# EAGLE design TickerTapeAlphanumeric (EAGLE 9.3.1)
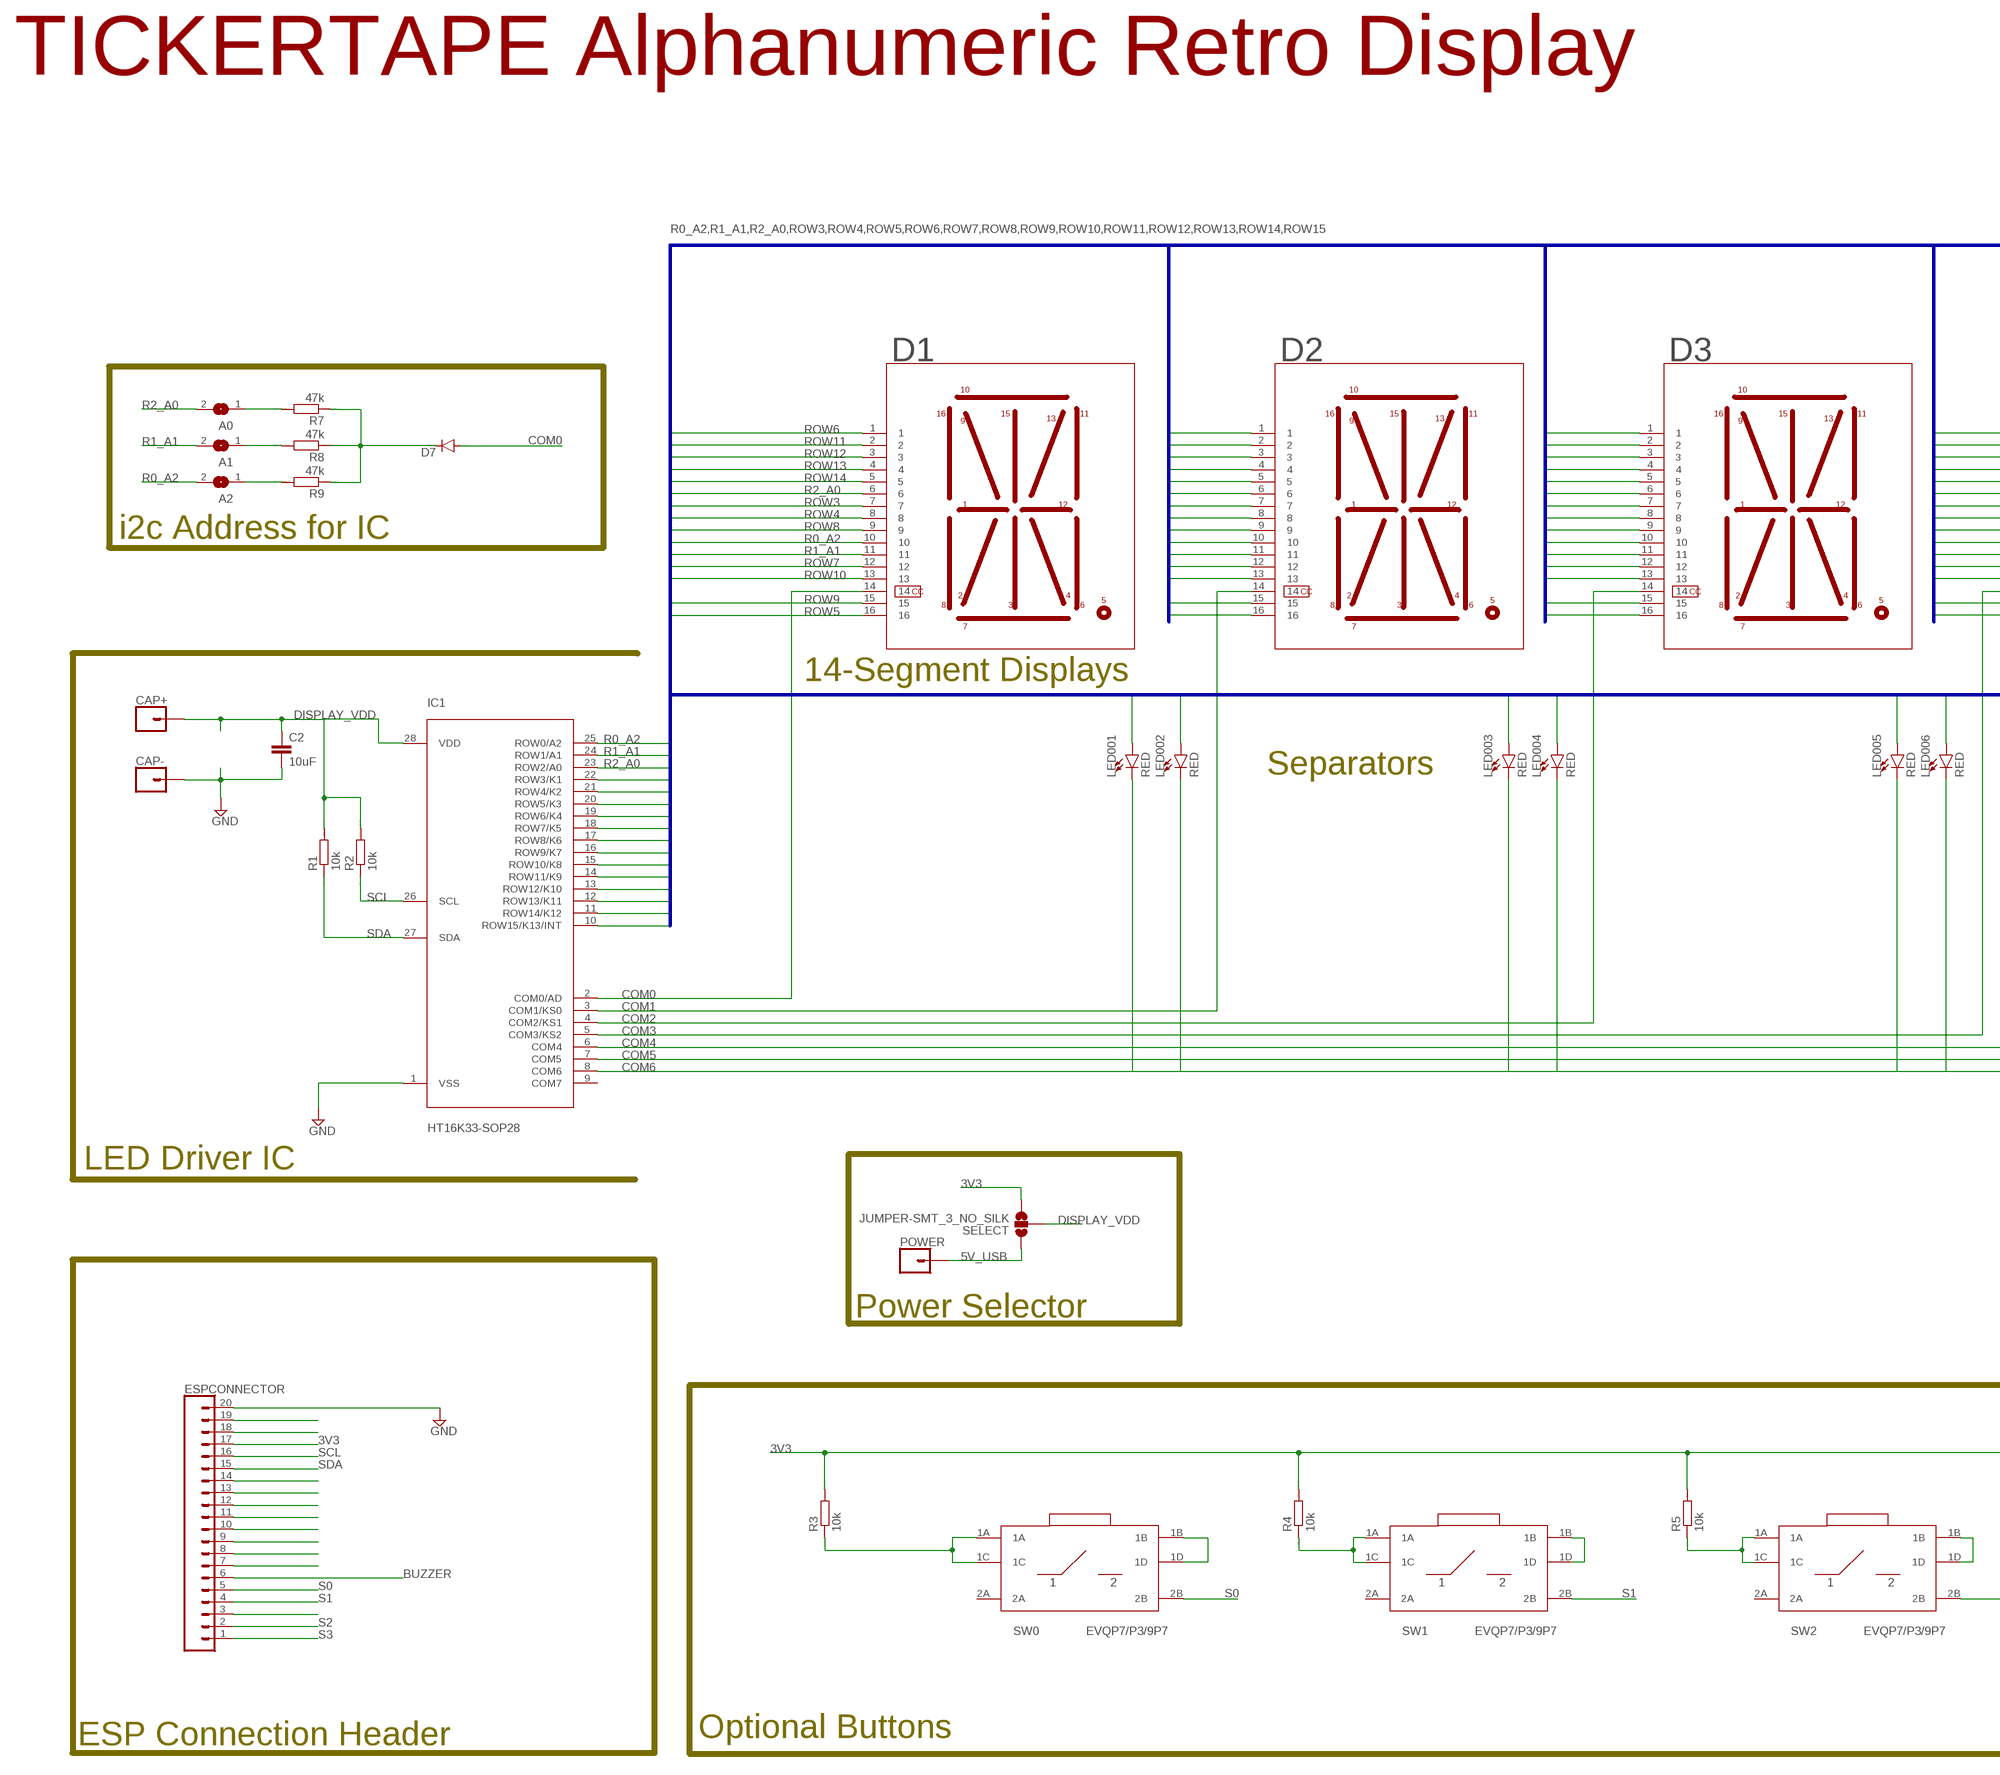
[diagram p0: schematic, sheet 1, part 1 of 2]
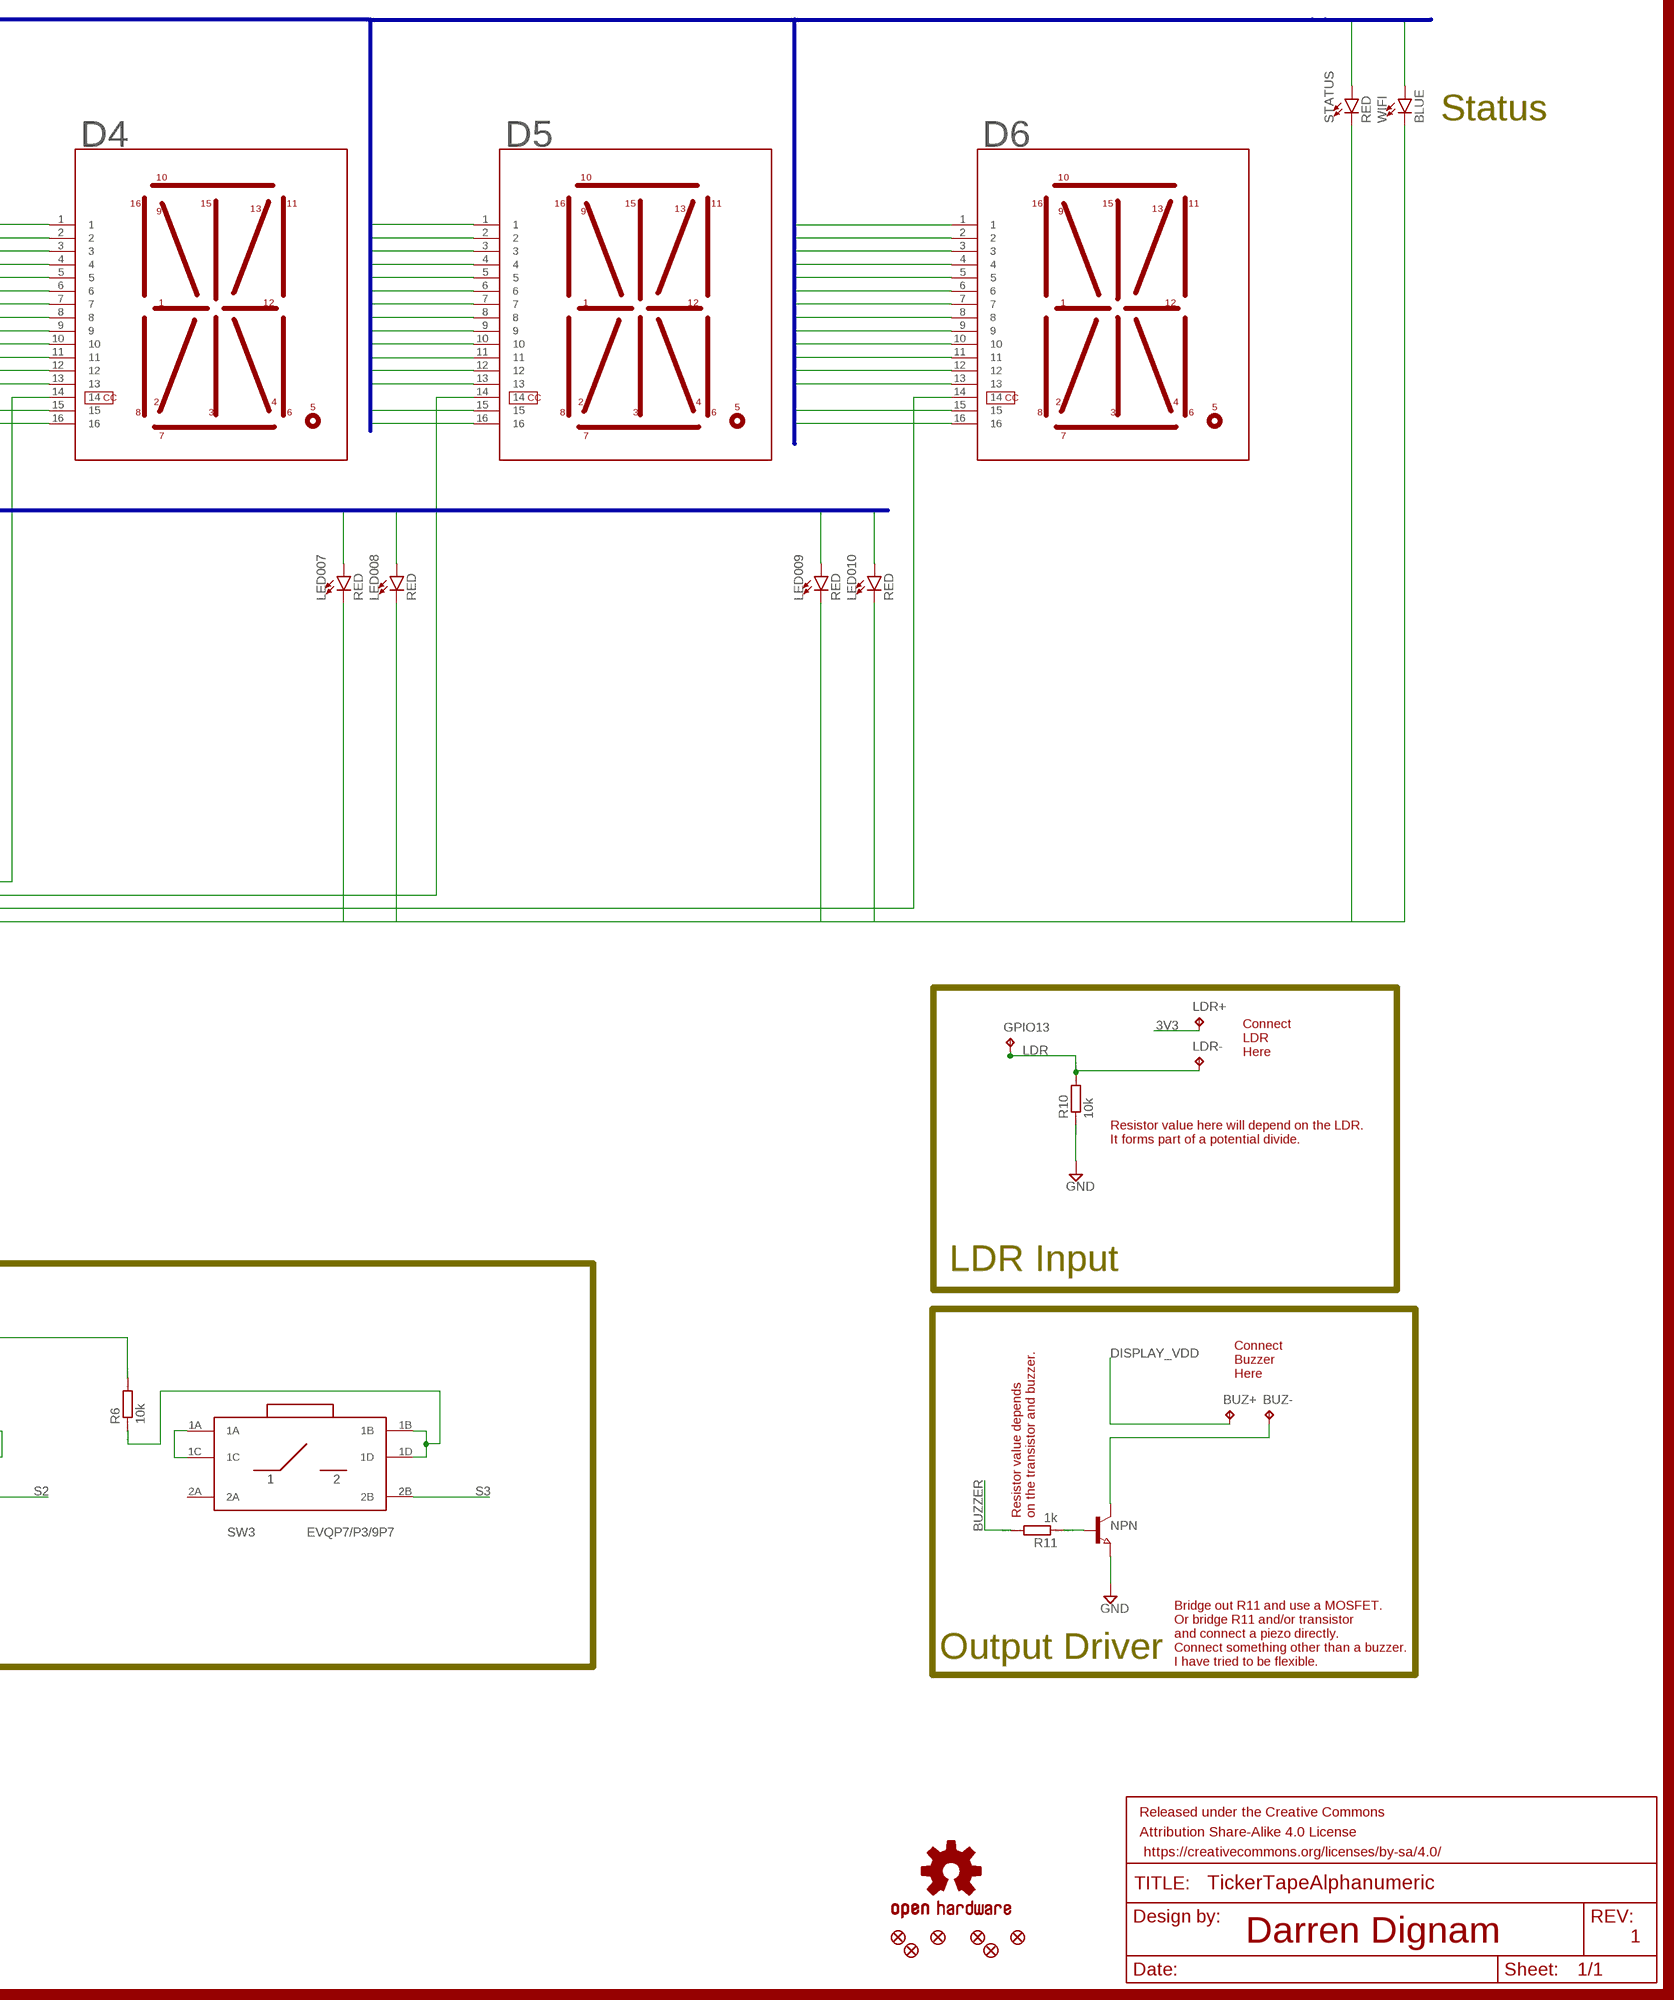
[diagram p1: schematic, sheet 1, part 2 of 2]

## Parts
A0  SOLDERJUMPERREFLOW_NOPASTE  [SOLDERJUMPER_REFLOW_NOPASTE]
A1  SOLDERJUMPERREFLOW_NOPASTE  [SOLDERJUMPER_REFLOW_NOPASTE]
A2  SOLDERJUMPERREFLOW_NOPASTE  [SOLDERJUMPER_REFLOW_NOPASTE]
BUZ+  TPB1,27  [B1,27]
BUZ-  TPB1,27  [B1,27]
C2  10uF  10UF-1206-6.3V-20%  [1206]
CAP+  CONN_01  [1X01]
CAP-  CONN_01  [1X01]
D1  KCPSC04-105  [14-SEGMENT-LED]
D2  KCPSC04-105  [14-SEGMENT-LED]
D3  KCPSC04-105  [14-SEGMENT-LED]
D4  KCPSC04-105  [14-SEGMENT-LED]
D5  KCPSC04-105  [14-SEGMENT-LED]
D6  KCPSC04-105  [14-SEGMENT-LED]
D7  DIODE-SOD323-W  [SOD323-W]
ESPCONNECTOR  CONN_20  [1X20]
FD1  FIDUCIALUFIDUCIAL  [FIDUCIAL-MICRO]
FD2  FIDUCIALUFIDUCIAL  [FIDUCIAL-MICRO]
FD3  FIDUCIALUFIDUCIAL  [FIDUCIAL-MICRO]
FD4  FIDUCIALUFIDUCIAL  [FIDUCIAL-MICRO]
FD5  FIDUCIALUFIDUCIAL  [FIDUCIAL-MICRO]
FD6  FIDUCIALUFIDUCIAL  [FIDUCIAL-MICRO]
FRAME1  FRAME-LEDGER  [CREATIVE_COMMONS]
GPIO13  TPB1,27  [B1,27]
IC1  HT16K33-SOP28  [SOIC127P1031X264-28N]
LDR+  TPB1,27  [B1,27]
LDR-  TPB1,27  [B1,27]
LED001  RED  LED-RED1206  [LED-1206]
LED002  RED  LED-RED1206  [LED-1206]
LED003  RED  LED-RED1206  [LED-1206]
LED004  RED  LED-RED1206  [LED-1206]
LED005  RED  LED-RED1206  [LED-1206]
LED006  RED  LED-RED1206  [LED-1206]
LED007  RED  LED-RED1206  [LED-1206]
LED008  RED  LED-RED1206  [LED-1206]
LED009  RED  LED-RED1206  [LED-1206]
LED010  RED  LED-RED1206  [LED-1206]
LOGO1  OSHW-LOGOM-COPPER  [OSHW-LOGO-M_COPPER]
NPN  NPN-TRANSISTOR_SOT23  [SOT23]
POWER  CONN_01  [1X01]
R1  10k  RR1206  [R1206]
R2  10k  RR1206  [R1206]
R3  10k  RR0603  [R0603]
R4  10k  RR0603  [R0603]
R5  10k  RR0603  [R0603]
R6  10k  RR0603  [R0603]
R7  47k  RR1206  [R1206]
R8  47k  RR1206  [R1206]
R9  47k  RR1206  [R1206]
R10  10k  RR1206  [R1206]
R11  1k  RR1206  [R1206]
SELECT  JUMPER-SMT_3_NO_SILK  [SMT-JUMPER_3_NO_SILK]
STATUS  RED  LED-RED1206  [LED-1206]
SW0  EVQP7/P3/9P7  [SMT5.5MMX2.5MM]
SW1  EVQP7/P3/9P7  [SMT5.5MMX2.5MM]
SW2  EVQP7/P3/9P7  [SMT5.5MMX2.5MM]
SW3  EVQP7/P3/9P7  [SMT5.5MMX2.5MM]
WIFI  BLUE  LED-RED1206  [LED-1206]

## Nets
3V3: ESPCONNECTOR.17 LDR+.TP R3.2 R4.2 R5.2 R6.2 SELECT.3
5V_USB: POWER.1 SELECT.1
BUZZER: ESPCONNECTOR.6 R11.2
COM0: D1.14 D7.A IC1.2(COM0/AD)
COM1: D2.14 IC1.3(COM1/KS0)
COM2: D3.14 IC1.4(COM2/KS1)
COM3: D4.14 IC1.5(COM3/KS2)
COM4: D5.14 IC1.6(COM4)
COM5: D6.14 IC1.7(COM5)
COM6: IC1.8(COM6) LED001.C LED002.C LED003.C LED004.C LED005.C LED006.C LED007.C LED008.C LED009.C LED010.C STATUS.C WIFI.C
DISPLAY_VDD: BUZ+.TP C2.1 CAP+.1 IC1.28(VDD) R1.2 R2.2 SELECT.2
GND: C2.2 CAP-.1 ESPCONNECTOR.20 IC1.1(VSS) NPN.2(E) R10.1
LDR: GPIO13.TP LDR-.TP R10.2
N$1: R3.1 SW0.1A SW0.1C
N$2: ESPCONNECTOR.19
N$3: ESPCONNECTOR.18
N$4: SW0.1B SW0.1D
N$5: R4.1 SW1.1A SW1.1C
N$6: SW1.1B SW1.1D
N$7: ESPCONNECTOR.14
N$8: ESPCONNECTOR.13
N$9: ESPCONNECTOR.12
N$10: ESPCONNECTOR.11
N$11: ESPCONNECTOR.10
N$12: ESPCONNECTOR.9
N$13: ESPCONNECTOR.8
N$14: ESPCONNECTOR.7
N$15: BUZ-.TP NPN.3(C)
N$16: R6.1 SW3.1B SW3.1D
N$17: D7.C R7.1 R8.1 R9.1
N$18: ESPCONNECTOR.3
N$19: A0.1 R7.2
N$20: A1.1 R8.2
N$21: R5.1 SW2.1A SW2.1C
N$22: SW2.1B SW2.1D
N$23: SW3.1A SW3.1C
N$24: A2.1 R9.2
N$25: NPN.1(B) R11.1
R0_A2: A2.2 D1.10 D2.10 D3.10 D4.10 D5.10 D6.10 IC1.25(ROW0/A2) LED001.A
R1_A1: A1.2 D1.11 D2.11 D3.11 D4.11 D5.11 D6.11 IC1.24(ROW1/A1) LED002.A
R2_A0: A0.2 D1.6 D2.6 D3.6 D4.6 D5.6 D6.6 IC1.23(ROW2/A0) LED003.A
ROW3: D1.7 D2.7 D3.7 D4.7 D5.7 D6.7 IC1.22(ROW3/K1) LED004.A
ROW4: D1.8 D2.8 D3.8 D4.8 D5.8 D6.8 IC1.21(ROW4/K2) LED005.A
ROW5: D1.16 D2.16 D3.16 D4.16 D5.16 D6.16 IC1.20(ROW5/K3) LED006.A
ROW6: D1.1 D2.1 D3.1 D4.1 D5.1 D6.1 IC1.19(ROW6/K4) LED007.A
ROW7: D1.12 D2.12 D3.12 D4.12 D5.12 D6.12 IC1.18(ROW7/K5) LED008.A
ROW8: D1.9 D2.9 D3.9 D4.9 D5.9 D6.9 IC1.17(ROW8/K6) LED009.A
ROW9: D1.15 D2.15 D3.15 D4.15 D5.15 D6.15 IC1.16(ROW9/K7) LED010.A
ROW10: D1.13 D2.13 D3.13 D4.13 D5.13 D6.13 IC1.15(ROW10/K8) STATUS.A
ROW11: D1.2 D2.2 D3.2 D4.2 D5.2 D6.2 IC1.14(ROW11/K9) WIFI.A
ROW12: D1.3 D2.3 D3.3 D4.3 D5.3 D6.3 IC1.13(ROW12/K10)
ROW13: D1.4 D2.4 D3.4 D4.4 D5.4 D6.4 IC1.12(ROW13/K11)
ROW14: D1.5 D2.5 D3.5 D4.5 D5.5 D6.5 IC1.11(ROW14/K12)
ROW15: IC1.10(ROW15/K13/INT)
S0: ESPCONNECTOR.5 SW0.2B
S1: ESPCONNECTOR.4 SW1.2B
S2: ESPCONNECTOR.2 SW2.2B
S3: ESPCONNECTOR.1 SW3.2B
SCL: ESPCONNECTOR.16 IC1.26(SCL) R2.1
SDA: ESPCONNECTOR.15 IC1.27(SDA) R1.1
Unconnected: IC1.9(COM7) SW0.2A SW1.2A SW2.2A SW3.2A

## Buses
R0_A2,R1_A1,R2_A0,ROW3,ROW4,ROW5,ROW6,ROW7,ROW8,ROW9,ROW10,ROW11,ROW12,ROW13,ROW14,ROW15

## Notes on the sheet
- TICKERTAPE Alphanumeric Retro Display
- Status
- i2c Address for IC
- 14-Segment Displays
- Separators
- LED Driver IC
- Connect 
  LDR
  Here
- Resistor value here will depend on the LDR. 
  It forms part of a potential divide.
- Power Selector
- LDR Input
- Connect 
  Buzzer
  Here
- Resistor value depends
  on the transistor and buzzer.
- ESP Connection Header | Optional Buttons | Output Driver
- Bridge out R11 and use a MOSFET.
  Or bridge R11 and/or transistor
  and connect a piezo directly.
  Connect something other than a buzzer.
  I have tried to be flexible.
- Darren Dignam | 1

## Library data of the parts
A0 A1 A2 = microbuilder:SOLDERJUMPER: SMD Solder JUMPER Solder the two pads together to create a connection, or remove the solder to break it. REFLOW - Use this footprint for solder paste and reflow ovens. WAVE - Use this footprint for hand-soldering (larger pads). CLOSED - Has a trace between the two pads to ensure it is closed by default. The trace needs to be cut to disable the jumper, and can be closed again by creating a solder bridge between the two pads.
BUZ+ BUZ- GPIO13 LDR+ LDR- = testpad:TP: Test pad
C2 = SparkFun-Capacitors:10UF: 10.0µF ceramic capacitors A capacitor is a passive two-terminal electrical component used to store electrical energy temporarily in an electric field.; PROD_ID: CAP-10057
CAP+ CAP- POWER = SparkFun-Connectors:CONN_01: Single connection point. Often used as Generic Header-pin footprint for 0.1 inch spaced/style header connections On any of the 0.1 inch spaced packages, you can populate with these: Break Away Headers - Straight <https://www.sparkfun.com/products/116> (PRT-00116) Break Away Male Headers - Right Angle <https://www.sparkfun.com/products/553> (PRT-00553) Female Headers <https://www.sparkfun.com/products/115> (PRT-00115) Break Away Headers - Machine Pin <https://www.sparkfun.com/products/117> (PRT-00117) Break Away Female Headers - Swiss Machine Pin <https://www.sparkfun.com/products/743> (PRT-00743) This device is also useful as a general connection point to wire up your design to another part of your project. Our various solder wires solder well into these plated through hole pads. Hook-Up Wire - Assortment (Stranded, 22 AWG) <https://www.sparkfun.com/products/11375> (PRT-11375) Hook-Up Wire - Assortment (Solid Core, 22 AWG) <https://www.sparkfun.com/products/11367> (PRT-11367) View the entire wire category on our website here <https://www.sparkfun.com/categories/141> Special notes: SMTSO-256-ET is a "flush mount" nut for a 4-40 screw. We mostly use this on specialty testbeds; it is a nice way to connect hardware to your PCB at an adjustable hieght. Also note, the SNAP packages are for using a snappable style connector. We sell a baggie of snaps and they are also used on two LilyPad designs: Snap Assortment - 30 pack (male and female) <https://www.sparkfun.com/products/11347> (DEV-11347) LilyPad Arduino SimpleSnap <https://www.sparkfun.com/products/10941> (DEV-10941) LilyPad SimpleSnap Protoboard <https://www.sparkfun.com/products/10940> (DEV-10940)
D1-D6 = Kingbright_LEDs:KCPSC04-105: 14-Segment LED Alphanumeric Display Module. Common Cathode 16 pin device.
D7 = diode:DIODE-: DIODE
ESPCONNECTOR = SparkFun-Connectors:CONN_20: Multi connection point. Often used as Generic Header-pin footprint for 0.1 inch spaced/style header connections On any of the 0.1 inch spaced packages, you can populate with these: Break Away Headers - Straight <https://www.sparkfun.com/products/116> (PRT-00116) Break Away Male Headers - Right Angle <https://www.sparkfun.com/products/553> (PRT-00553) Female Headers <https://www.sparkfun.com/products/115> (PRT-00115) Break Away Headers - Machine Pin <https://www.sparkfun.com/products/117> (PRT-00117) Break Away Female Headers - Swiss Machine Pin <https://www.sparkfun.com/products/743> (PRT-00743) For SCREWTERMINALS and SPRING TERMINALS visit here: Screw Terimnals on SparkFun.com <https://www.sparkfun.com/search/results?term=Screw+Terminals> (5mm/3.5mm/2.54mm spacing) This device is also useful as a general connection point to wire up your design to another part of your project. Our various solder wires solder well into these plated through hole pads. Hook-Up Wire - Assortment (Stranded, 22 AWG) <https://www.sparkfun.com/products/11375> (PRT-11375) Hook-Up Wire - Assortment (Solid Core, 22 AWG) <https://www.sparkfun.com/products/11367> (PRT-11367) View the entire wire category on our website here <https://www.sparkfun.com/categories/141> Special notes: Molex polarized connector foot print use with SKU : PRT-08231 with associated crimp pins and housings. 1MM SMD Version SKU: PRT-10208 NOTES ON THE VARIANTS LOCK and LOCK_LONGPADS... This footprint was designed to help hold the alignment of a through-hole component (i.e. 6-pin header) while soldering it into place. You may notice that each hole has been shifted either up or down by 0.005 of an inch from it's more standard position (which is a perfectly straight line). This slight alteration caused the pins (the squares in the middle) to touch the edges of the holes. Because they are alternating, it causes a "brace" to hold the component in place. 0.005 has proven to be the perfect amount of "off-center" position when using our standard breakaway headers. Although looks a little odd when you look at the bare footprint, once you have a header in there, the alteration is very hard to notice. Also,if you push a header all the way into place, it is covered up entirely on the bottom side. Note about LOCK SPECIAL package: This is just like the LOCK variant in that the holes are staggared by 5 mil, but except for the last two holes. They are not altered from the "standard" footprint layout. This is used for a special purpose on the layout of our Graphic LCD Backpack. Make sure you want to use this device before selecting it for you project!
FD1-FD6 = SparkFun-Aesthetics:FIDUCIAL: Fiducial Alignment Points Point-of-reference for pick-and-place machines and other optical instruments.
FRAME1 = SparkFun-Aesthetics:FRAME-LEDGER: Schematic Frame - Ledger Standard 11x14 US Ledger frame
IC1 = holtek-led-controller-v1:HT16K33-SOP28: RAM Mapping 16*8 LED Controller Driver with keyscan
LED001-LED009 LED010 STATUS = SparkFun-LED:LED-RED: Red SMD LED Used in manufacturing of most products at SparkFun Packages: 0603 - SMD 0603 package [Product Link] <http://docs.avagotech.com/docs/AV02-0551EN> 0603 SMART - SMD 0603 SMART package ( more efficient and expensive)[Product Link] <http://www.osram-os.com/Graphics/XPic2/00077099_0.pdf> 1206 - SMD1206 package [Product Link] <https://www.sparkfun.com/datasheets/DevTools/LilyPad/Q150OVS4.pdff> SparkFun Products: Pro Mini 328 -5V <https://www.sparkfun.com/products/821> RedBoard <https://www.sparkfun.com/products/12757> IOIO-OTG <https://www.sparkfun.com/products/13613>; PROD_ID: DIO-09912
LOGO1 = SparkFun-Aesthetics:OSHW-LOGO: Open-Source Hardware (OSHW) Logo This logo indicates the piece of hardware it is found on incorporates a OSHW license and/or adheres to the definition of open source hardware found here: http://freedomdefined.org/OSHW
NPN = semicon-smd-ipc:NPN-TRANSISTOR_: NPN TRANSISTOR
R1-R11 = eagle-ltspice:R: RESISTOR, European symbol; SPICEMODEL: NONE; SPICEPREFIX: R
SELECT = SparkFun-Jumpers:JUMPER-SMT_3_NO: Normally open jumper This jumper has three pads in close proximity to each other. Apply solder to close the connection(s).
SW0 SW1-SW3 = PanasonicSwitches:EVQP7/P3/9P7: SMT Side Activated push button SPST There are three styles - and I hope that this device footprint can handle all three, as they are fairly similar... But It is designed primarily for the type with plated through holes in the smt pad
WIFI = SparkFun-LED:LED-RED: Red SMD LED Used in manufacturing of most products at SparkFun Packages: 0603 - SMD 0603 package [Product Link] <http://docs.avagotech.com/docs/AV02-0551EN> 0603 SMART - SMD 0603 SMART package ( more efficient and expensive)[Product Link] <http://www.osram-os.com/Graphics/XPic2/00077099_0.pdf> 1206 - SMD1206 package [Product Link] <https://www.sparkfun.com/datasheets/DevTools/LilyPad/Q150OVS4.pdff> SparkFun Products: Pro Mini 328 -5V <https://www.sparkfun.com/products/821> RedBoard <https://www.sparkfun.com/products/12757> IOIO-OTG <https://www.sparkfun.com/products/13613>; PROD_ID: DIO-09912; VALUE: RED

## Board
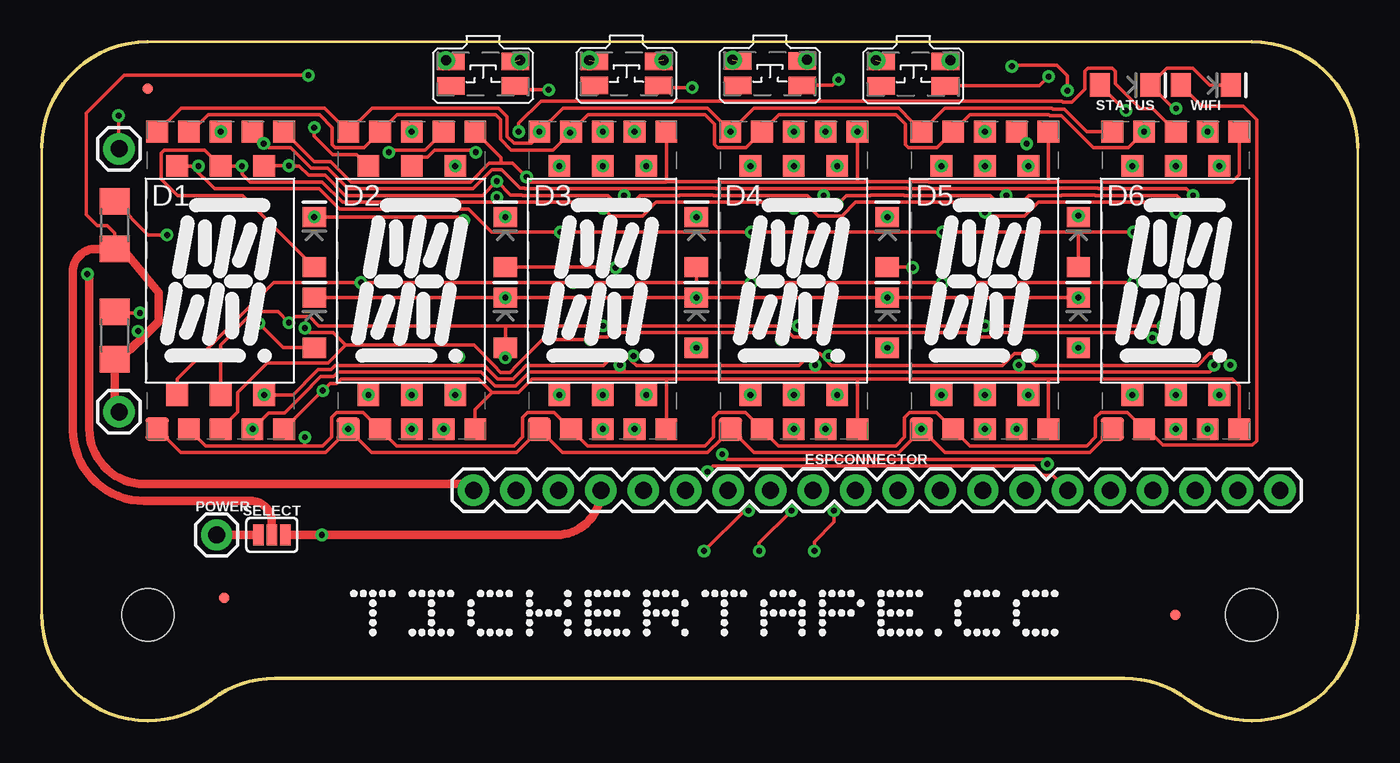
[diagram p2: board, top side]
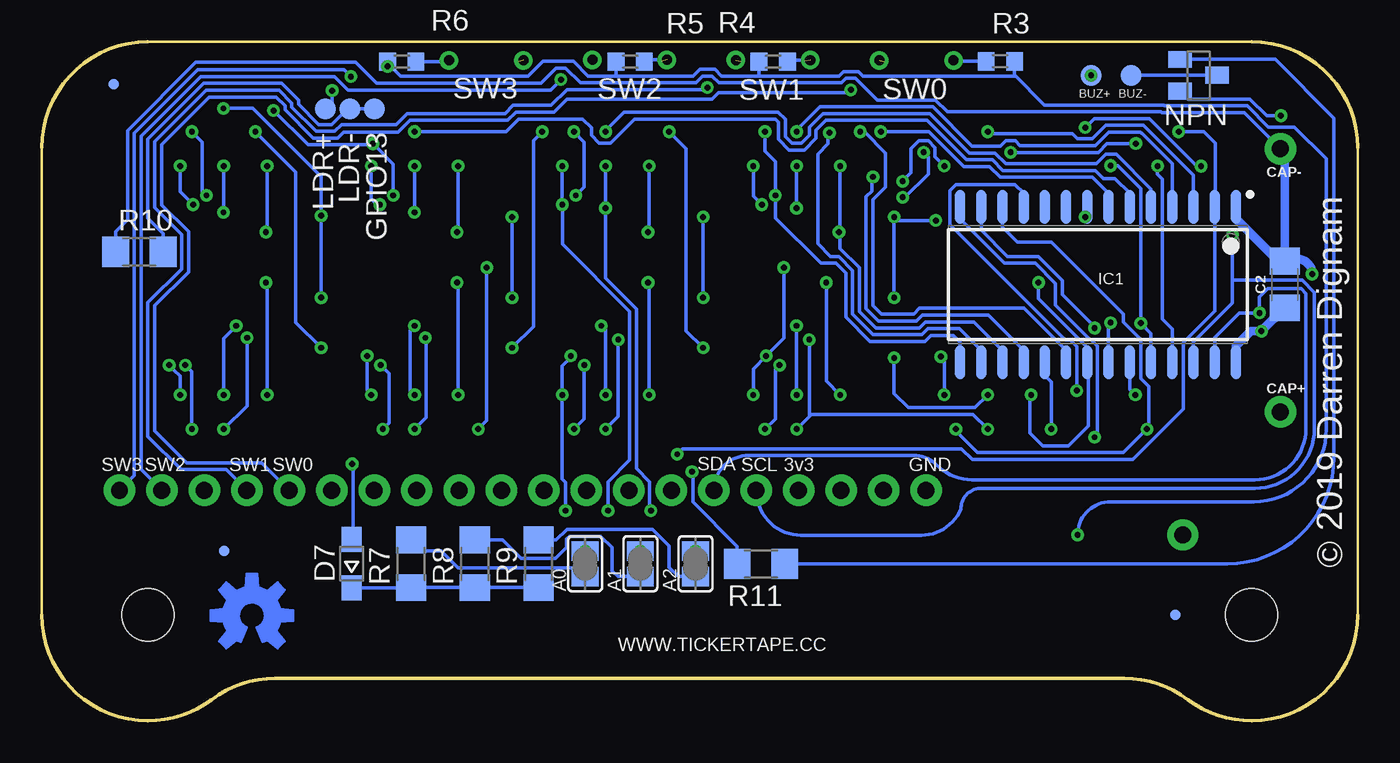
[diagram p3: board, bottom side, seen from below]

Size 78.74 x 40.64 mm. Coordinates in mm from the lower left corner, seen from the top.
Outline: 72.39,40.64 6.35,40.64 arc90 0,34.29 0,6.35 arc90 6.35,0 arc37 10.16,1.27 arc-37 13.97,2.54 64.77,2.54 arc-37 68.58,1.27 arc37 72.39,0 arc90 78.74,6.35 78.74,34.29 arc90 72.39,40.64
Copper layers (1*16): Top 0.035mm / dielectric 1.5mm / Bottom 0.035mm
Design rules "default *": minimum track width 8mil, minimum drill 0.35mm, track to track 8mil, track to pad 8mil, pad to pad 8mil, via to via 8mil, smd to smd 8mil, copper to edge 40mil, drill to drill 6mil, minimum pad ring 10mil, minimum via ring 8mil, stop-mask expansion 4mil, vias tented up to drill 14mil, thermal gap 10mil
Holes 3.12 mm at 6.35,6.35 72.39,6.35

### Footprints (pad centres in the part's own frame; a part is rotated, then mirrored left to right if it is on the bottom)
SOLDERJUMPER_REFLOW_NOPASTE = smd 1.168 x 1.6: 1 -0.762,0; 2 0.762,0
B1,27 = smd 1.27 x 1.27: TP 0,0
1206 = smd 1.6 x 1.8: 1 -1.4,0; 2 1.4,0
1X01 = drill 1.016 pad 1.88: 1 0,0
14-SEGMENT-LED = smd 1.4 x 1.4: 1 0,-17.8 | smd 1.3 x 1.3: 2 1.9,-17.8; 3 3.8,-17.8; 4 5.7,-17.8; 5 7.6,-17.8; 6 6.4,-15.75; 7 3.8,-15.75; 8 1.2,-15.75; 9 1.2,-2.05; 10 3.8,-2.05; 11 6.4,-2.05; 12 7.6,0; 13 5.7,0; 14 3.8,0; 15 1.9,0; 16 0,0
SOD323-W = smd 1.5 x 1.2: A 1.45,0; C -1.45,0
1X20 = drill 1.016 pad 1.88: 1 0,0; 2 2.54,0; 3 5.08,0; 4 7.62,0; 5 10.16,0; 6 12.7,0; 7 15.24,0; 8 17.78,0; 9 20.32,0; 10 22.86,0; 11 25.4,0; 12 27.94,0; 13 30.48,0; 14 33.02,0; 15 35.56,0; 16 38.1,0; 17 40.64,0; 18 43.18,0; 19 45.72,0; 20 48.26,0
FIDUCIAL-MICRO = smd 0.635 x 0.635: 1 0,0
SOIC127P1031X264-28N = smd 2.05 x 0.6: 1 -4.65,8.255; 2 -4.65,6.985; 3 -4.65,5.715; 4 -4.65,4.445; 5 -4.65,3.175; 6 -4.65,1.905; 7 -4.65,0.635; 8 -4.65,-0.635; 9 -4.65,-1.905; 10 -4.65,-3.175; 11 -4.65,-4.445; 12 -4.65,-5.715; 13 -4.65,-6.985; 14 -4.65,-8.255; 15 4.65,-8.255; 16 4.65,-6.985; 17 4.65,-5.715; 18 4.65,-4.445; 19 4.65,-3.175; 20 4.65,-1.905; 21 4.65,-0.635; 22 4.65,0.635; 23 4.65,1.905; 24 4.65,3.175; 25 4.65,4.445; 26 4.65,5.715; 27 4.65,6.985; 28 4.65,8.255
LED-1206 = smd 1.2 x 1.4: A -1.5,0; C 1.5,0
SOT23 = smd 1 x 1.4: 1 -0.95,-1.1; 2 0.95,-1.1; 3 0,1.1
R1206 = smd 1.6 x 1.803: 1 -1.422,0; 2 1.422,0
R0603 = smd 1 x 1.1: 1 -0.85,0; 2 0.85,0
SMT-JUMPER_3_NO_SILK = smd 0.635 x 1.27: 1 -0.813,0; 2 0,0; 3 0.813,0
SMT5.5MMX2.5MM = smd 1.65 x 1.05: 1A -1.915,0.725; 1B 1.935,0.725; 2A -1.915,-0.725; 2B 1.935,-0.725 | drill 0.6 pad 0.85: 1C -2.215,0.8; 1D 2.235,0.8

### Placement (x,y rotation side)
A0  46.23,9.4 90 bottom
A1  42.93,9.4 90 bottom
A2  39.62,9.4 90 bottom
BUZ+  15.95,38.63 0 bottom
BUZ-  13.56,38.63 0 bottom
C2  4.37,26.11 90 bottom
CAP+  4.62,18.49 0 top
CAP-  4.62,34.24 0 top
D1  6.91,35.26 0 top
D2  18.34,35.26 0 top
D3  29.77,35.26 0 top
D4  41.2,35.26 0 top
D5  52.63,35.26 0 top
D6  64.06,35.26 0 top
D7  60.2,9.4 90 bottom
ESPCONNECTOR  74.09,13.79 180 top
FD1  6.35,37.85 0 top
FD2  67.82,6.35 0 top
FD3  74.42,38.1 0 bottom
FD4  10.92,6.35 0 bottom
FD5  10.92,7.37 0 top
FD6  67.82,10.16 180 bottom
FRAME1  18.62,-13.94 0 top  (outside the outline)
GPIO13  58.83,36.63 0 bottom
IC1  15.54,26.11 270 bottom
LDR+  61.77,36.63 0 bottom
LDR-  60.3,36.63 0 bottom
LED001  16.31,28.65 90 top
LED002  16.31,23.83 90 top
LED003  27.74,28.65 90 top
LED004  27.74,23.83 90 top
LED005  39.17,28.65 90 top
LED006  39.17,23.83 90 top
LED007  50.6,28.65 90 top
LED008  50.6,23.83 90 top
LED009  62.03,28.65 90 top
LED010  62.03,23.83 90 top
LOGO1  66.17,6.3 0 bottom
NPN  9.53,38.63 270 bottom
POWER  10.46,11.13 0 top
R1  4.37,23.06 270 top
R2  4.37,29.67 270 top
R3  21.39,39.47 0 bottom
R4  34.98,39.45 180 bottom
R5  43.54,39.45 180 bottom
R6  57.2,39.45 180 bottom
R7  56.64,9.4 90 bottom
R8  52.83,9.4 90 bottom
R9  49.02,9.4 90 bottom
R10  72.9,28.07 0 bottom
R11  35.71,9.4 180 bottom
SELECT  13.77,11.13 0 top
STATUS  64.82,38.05 0 top
SW0  26.39,38.73 0 top
SW1  34.98,38.75 0 top
SW2  43.55,38.75 0 top
SW3  52.13,38.73 0 top
WIFI  69.65,38.05 0 top

### Tracks (layer width: path | path; a pad name or v marks a point on that pad's centre or on a via)
3V3  (via drill 0.35)
  Top 0.203: v61.37,37.72 61.37,38.61 60.73,39.24 58.12,39.24 v58.05,39.17
  Top 0.508: SELECT.3 v16.76,11.12 30.79,11.12 arc90 ESPCONNECTOR.17
  Bottom 0.203: R4.2 35.83,38.6 35.84,38.59 | R5.2 44.39,38.6 arc90 44.4,38.59 | v16.76,11.12 arc90 14.78,13.11 6.22,13.11 arc-90 1.88,17.45 1.88,33.63 3.79,35.53 5.34,35.53 6.61,36.8 11.56,36.8 11.61,36.86 18.74,36.86 20.54,38.66 | R3.2 20.54,38.66 | 20.54,38.66 20.54,38.6 arc90 20.55,38.59 29.61,38.59 29.88,38.86 30.78,38.86 31.04,38.59 35.84,38.59 | v61.37,37.72 61.37,37.03 LDR+.TP | v58.05,39.17 R6.2 58.05,39.39 57.26,38.59 49.64,38.59 48.75,39.48 46.94,39.48 46.04,38.59 44.4,38.59 | 44.4,38.59 39.76,38.59 39.36,38.99 38.46,38.99 38.07,38.59 35.84,38.59
5V_USB
  Top 0.508: POWER.1 SELECT.1
BUZZER  (via drill 0.35)
  Top 0.203: v39.83,14.9 40.17,15.24 59.34,15.24 59.89,14.69 60.5,14.69 ESPCONNECTOR.6
  Bottom 0.203: v39.83,14.9 39.78,14.85 39.78,13.09 37.13,10.44 R11.2
COM0  (via drill 0.35)
  Top 0.203: D1.14 | v40.71,15.96 40.71,15.94 41.01,15.65 59.9,15.65 v60.17,15.37
  Bottom 0.203: v40.71,15.96 40.39,16.28 23.7,16.28 23.07,15.65 13.45,15.65 10.44,18.66 10.44,22.65 8.56,24.53 IC1.2 8.51,30.81 8.51,34.57 9.2,35.26 D1.14 | v60.17,15.37 60.17,15.29 60.1,15.21 60.1,10.95 D7.A 60.2,10.63 arc-90 60.15,10.58
  other vias: 10.71,35.26
COM1  (via drill 0.35)
  Bottom 0.203: IC1.3 9.83,32.66 12.76,35.59 12.77,35.59 12.83,35.64 15.06,35.64 15.87,34.83 16.77,34.83 17.07,35.13 22.01,35.13 D2.14
  other vias: 22.14,35.26
COM2  (via drill 0.35)
  Bottom 0.203: IC1.4 11.1,33.35 12.93,35.18 12.94,35.18 12.99,35.23 14.89,35.23 15.7,34.42 20.2,34.42 20.49,34.71 21.05,34.71 21.37,34.39 23.07,34.39 25.43,36.75 32.17,36.75 33.57,35.35 D3.14
  other vias: 33.57,35.26
COM3  (via drill 0.35)
  Bottom 0.203: IC1.5 12.37,31.83 14.45,33.91 15.07,33.91 15.63,33.34 21.05,33.34 21.7,33.98 23.24,33.98 25.6,36.34 32,36.34 32.82,35.53 32.82,35.04 33.29,34.57 33.85,34.57 34.25,34.97 34.25,35.99 34.68,36.42 43.91,36.42 45,35.33 D4.14
  other vias: 45,35.26
COM4  (via drill 0.35)
  Bottom 0.203: IC1.6 13.64,31.57 14.53,32.46 15.22,32.46 15.7,32.93 21.22,32.93 21.87,33.58 23.41,33.58 25.77,35.94 31.83,35.94 32.41,35.36 32.41,34.87 33.12,34.17 34.02,34.17 34.66,34.8 34.66,35.83 34.85,36.02 43.27,36.02 44.72,34.57 45.38,34.57 45.86,35.05 45.86,35.5 46.38,36.02 50.21,36.02 50.97,35.26 D5.14
  other vias: 56.43,35.26
COM5  (via drill 0.35)
  Top 0.203: v28.54,35.26 28.54,35.76 29.87,37.08 61.03,37.08 61.08,37.04 61.65,37.04 62.42,37.8 62.42,38.88 62.59,39.05 64.05,39.05 64.23,38.88 64.23,38.14 65.74,36.63 66.49,36.63 D6.14
  Bottom 0.203: IC1.7 15.04,30.89 15.04,31.7 15.87,32.53 21.39,32.53 22.03,33.17 23.58,33.17 25.67,35.27 28.53,35.27 v28.54,35.26
COM6  (via drill 0.35)
  Top 0.203: LED002.C LED004.C LED006.C LED008.C LED010.C | LED001.C 25.04,30.15 v25.25,29.94 | WIFI.C 69.88,38.05 68.87,39.05 67.33,39.05 STATUS.C 67.72,36.65 v67.87,36.65 | v62.03,30.23 LED009.C
  Bottom 0.203: LED010.C v62.03,30.23 62.03,32.56 66.12,36.65 v67.87,36.65 | LED007.C LED008.C | LED005.C LED006.C | LED003.C 27.74,29.92 | 27.74,29.92 LED004.C | v25.25,29.94 27.72,29.94 27.74,29.92 | LED001.C 16.18,30.28 IC1.8
  other vias: 27.74,30.15 27.74,25.33 39.17,30.15 39.17,25.33 50.6,30.15 50.6,25.33 62.03,25.33 16.31,30.15
DISPLAY_VDD  (via drill 0.35)
  Top 0.203: R2.2 4.37,29.18 3.91,29.64 3.33,29.64 2.67,30.3 2.67,36.37 4.93,38.63 BUZ+.TP
  Top 0.508: v5.76,23.32 6.02,23.06 6.15,23.06 | SELECT.2 13.77,11.89 arc90 12.5,13.16 6.12,13.16 arc-90 1.85,17.42 1.85,26.87 arc-90 3.23,28.25 4.83,28.25 4.9,28.17 | CAP+.1 4.37,18.75 R1.2 5.3,22.21 6.15,23.06 | R2.2 4.9,28.17 | 4.9,28.17 6.99,25.63 6.99,23.9 6.15,23.06
  Bottom 0.508: IC1.28 7.29,22.43 6.4,23.32 v5.76,23.32 C2.1
  other vias: 15.95,38.63
GND  (via drill 0.35)
  Top 0.203: v4.6,36.22 4.6,34.27 CAP-.1
  Top 0.508: v2.73,26.74 arc-90 2.85,26.62 2.85,17.48 arc90 6.15,14.17 25.45,14.17 arc-90 ESPCONNECTOR.20
  Bottom 0.203: C2.2 4.75,27.51 | NPN.2 10.15,37.21 6.45,37.21 5.45,36.22 v4.6,36.22 | CAP-.1 6.78,36.4 11.72,36.4 11.78,36.45 24.56,36.45 25.26,37.16 28.75,37.16 30.05,38.45 30.61,38.45 30.88,38.18 38.23,38.18 38.63,38.58 39.2,38.58 39.59,38.19 44.44,38.19 44.45,38.18 46.51,38.18 47.39,39.06 47.96,39.06 48.87,38.15 58.7,38.15 59.97,39.42 69.52,39.42 73.61,35.33 73.61,30 74.32,29.29 R10.1
  Bottom 0.508: IC1.1 7.29,30.05 4.75,27.51 | v2.73,26.74 2.73,26.75 arc-90 3.61,27.64 4.25,27.64 arc-90 C2.2 4.37,33.98 CAP-.1
LDR
  Bottom 0.203: R10.2 71.48,29.16 72.39,30.07 72.39,34.82 69.06,38.15 64.38,38.15 63.38,37.15 63.38,36.9 62.16,35.69 61.38,35.69 60.44,36.63 LDR-.TP GPIO13.TP
N$1
  Top 0.203: SW0.1A 24.25,39.46 SW0.1C
  Bottom 0.203: SW0.1C 24.12,39.47 R3.1
N$4  (1 unrouted)
N$5  (1 unrouted)
  Bottom 0.203: SW1.1C 34.02,39.55 R4.1
N$6  (1 unrouted)
N$15
  Bottom 0.203: NPN.3 BUZ-.TP
N$16
  Top 0.203: SW3.1D 54.3,39.45 SW3.1B
  Bottom 0.203: R6.1 54.37,39.45 SW3.1D
N$17
  Bottom 0.203: R9.1 R8.1 R7.1 56.67,7.95 D7.C
N$19
  Bottom 0.203: R7.2 55.98,10.16 54.84,10.16 53.84,9.16 46.75,9.16 A0.1
N$20
  Bottom 0.203: R8.2 51.16,10.82 50.05,9.71 47.99,9.71 47.33,10.38 47.33,10.87 47.15,11.05 45.3,11.05 44.62,10.36 44.62,8.98 44.27,8.64 A1.1
N$21  (1 unrouted)
  Bottom 0.203: SW2.1C 42.58,39.55 R5.1
N$22
  Top 0.203: SW2.1B 45.72,39.48 SW2.1D
N$23  (1 unrouted)
N$24
  Bottom 0.203: R9.2 47.96,10.82 47.32,11.46 42.19,11.46 41.2,10.46 41.2,9.2 40.64,8.64 A2.1
N$25
  Bottom 0.203: R11.1 7.8,9.4 arc-90 1.42,15.77 1.42,17.32 1.42,36.07 4.94,39.58 NPN.1
R0_A2  (via drill 0.35)
  Top 0.203: 27.23,31.06 28.56,31.06 28.59,31.03 33.23,31.03 v33.58,30.68 34.05,30.21 35.94,30.21 36.76,31.03 38.32,31.03 38.34,31.06 39.99,31.06 40.02,31.03 44.66,31.03 v45.01,30.68 46.01,30.68 46.48,30.21 47.88,30.21 48.7,31.03 49.75,31.03 49.77,31.06 51.42,31.06 51.45,31.03 55.84,31.03 v56.44,30.43 56.66,30.21 58.8,30.21 59.62,31.03 61.18,31.03 61.2,31.06 62.85,31.06 62.88,31.03 67.27,31.03 v67.87,30.43 | 27.23,31.06 26.91,31.06 26.89,31.03 17.99,31.03 16.77,32.25 12.45,32.25 11.98,32.73 v11.98,33.2 D1.10 9.75,34.16 7.33,34.16 7.15,33.98 7.15,32.43 8.14,31.44 12.02,31.44 LED001.A | D2.10 22.15,33.73 22.16,33.74 23.1,33.74 23.52,34.16 25.83,34.16 v25.97,34.02 | v27.23,31.33 27.23,31.06 | v42.29,12.57 42.04,12.57 A2.2
  Bottom 0.203: D4.10 45,30.69 v45.01,30.68 45.01,26.51 43.16,24.65 43.16,15.1 42.37,14.31 42.37,12.65 v42.29,12.57 | D5.10 v56.43,30.44 v56.44,30.43 | v33.58,30.68 33.58,33.2 D3.10 | D6.10 67.87,33.2 v67.87,30.43 | IC1.25 11.1,23.44 11.71,24.05 11.71,32.43 11.99,32.72 11.99,33.2 v11.98,33.2 | v25.97,34.02 25.69,33.75 25.69,32.73 27.09,31.33 v27.23,31.33
  other vias: 39.62,10.16 33.57,33.21 45,33.21 56.43,33.21 67.86,33.21
R1_A1  (via drill 0.35)
  Top 0.203: v69.69,30.89 69.55,30.89 69.42,30.76 68.6,30.76 67.93,31.44 63.05,31.44 63.02,31.46 61.03,31.46 61.01,31.44 59.06,31.44 v58.51,30.89 58.38,30.76 57.43,30.76 56.75,31.44 51.62,31.44 51.59,31.46 49.6,31.46 49.58,31.44 48.14,31.44 v47.59,30.89 47.46,30.76 46.5,30.76 45.83,31.44 40.19,31.44 40.16,31.46 38.17,31.46 38.15,31.44 35.81,31.44 35.46,31.09 | D1.11 13.33,33.22 v14.78,33.22 14.8,33.2 15.41,33.2 15.96,32.66 16.94,32.66 18.16,31.44 26.37,31.44 v27.22,32.29 v27.23,32.29 28.07,31.46 28.73,31.46 28.76,31.44 33.89,31.44 34.57,30.76 35.13,30.76 35.46,31.09 | LED002.A 14.44,22.32 v12.97,23.8 | v35.65,30.89 35.46,31.09 | v44.86,12.57 42.93,10.64 A1.2
  Bottom 0.203: D4.11 v47.6,30.9 v47.59,30.89 47.59,28.52 43.56,24.49 43.56,15.6 44.86,14.31 v44.86,12.57 | v58.51,30.89 58.56,30.94 58.73,30.94 59.03,31.24 D5.11 | v35.65,30.89 36.17,31.41 D3.11 | v69.69,30.89 70.46,31.66 D6.11 | IC1.24 12.37,23.19 v12.97,23.8 12.97,31.86 14.34,33.22 v14.78,33.22 | v27.23,32.29 26.72,32.8 26.72,34.24 26.25,34.71 25.69,34.71 25.29,34.31 25.29,33.75 D2.11
  other vias: 42.93,10.16 24.74,33.21 36.17,33.21 47.6,33.21 59.03,33.21 70.46,33.21
R2_A0  (via drill 0.35)
  Top 0.203: D1.6 15.05,19.5 15.72,20.18 15.72,20.21 16.53,21.01 17.3,21.01 17.56,21.27 24.94,21.27 | 46.89,21.64 46.56,21.97 46,21.97 45.3,21.27 35.57,21.27 35.33,21.51 | 46.89,21.64 47.26,21.27 57.49,21.27 58.19,21.97 58.75,21.97 58.88,21.84 | 35.33,21.51 34.88,21.97 34.31,21.97 33.62,21.27 28.99,21.27 28.83,21.11 28.83,21.09 28.19,20.45 27.29,20.45 26.65,21.09 26.65,21.11 26.48,21.27 24.94,21.27 | 35.33,21.51 35.33,21.77 v35.4,21.84 | v71.11,21.29 70.84,21.56 70.84,21.57 70.44,21.97 69.87,21.97 69.18,21.27 59.45,21.27 58.88,21.84 | LED003.A 34.32,27.15 v34.34,27.13 | v47.08,21.84 46.89,21.64 | v59.28,21.84 58.88,21.84 | v24.94,21.79 24.94,21.27 | v47.4,12.57 47.4,11.89 46.23,10.72 A0.2
  Bottom 0.203: v47.08,21.84 47.08,21.75 47.6,21.23 D4.6 47.6,14.46 47.4,14.26 v47.4,12.57 | D5.6 59.03,19.56 59.28,19.8 v59.28,21.84 | D3.6 36.17,21.07 v35.4,21.84 34.34,22.9 v34.34,27.13 | D6.6 70.46,20.62 70.84,21 70.84,21.01 v71.11,21.29 | D2.6 24.74,21.59 v24.94,21.79 | IC1.23 13.64,19.84 D1.6
  other vias: 46.23,10.16 47.6,19.51 13.31,19.51 24.74,19.51 36.17,19.51 59.03,19.51 70.46,19.51
ROW3  (via drill 0.35)
  Top 0.203: v67.11,23.64 v56.44,23.64 v45.26,23.64 v33.58,23.64 27.74,23.64 | 27.74,23.64 16.58,23.64 16.02,24.19 15.15,24.19 v14.78,23.82 14.13,24.48 12.69,24.48 10.71,22.5 D1.7 | 27.74,23.64 LED004.A v27.74,21.72
  Bottom 0.203: D4.7 45,23.37 v45.26,23.64 | v56.44,23.64 56.43,23.63 56.69,23.36 56.69,19.77 D5.7 | D3.7 33.57,23.63 v33.58,23.64 | v67.11,23.64 67.86,22.88 D6.7 | IC1.22 14.91,23.44 14.78,23.57 v14.78,23.82 | D2.7 22.9,18.75 26.9,18.75 27.74,19.58 v27.74,21.72
  other vias: 45,19.51 22.14,19.51 33.57,19.51 56.43,19.51 67.86,19.51
ROW4  (via drill 0.35)
  Top 0.203: 39.17,26.23 v31.8,26.23 v19.1,26.23 13.87,26.23 8.11,20.47 D1.8 | 39.17,26.23 v42.47,26.23 v53.9,26.23 v65.33,26.23 | LED005.A 39.17,26.23
  Bottom 0.203: D4.8 42.4,26.16 v42.47,26.23 | D5.8 53.83,26.16 v53.9,26.23 | D6.8 65.26,26.16 v65.33,26.23 | v31.8,26.23 31.8,20.34 D3.8 | v19.1,26.23 19.1,25.27 16.18,22.35 IC1.21 16.13,21.41 16.13,17.65 17.32,16.46 18.85,16.46 19.61,17.22 19.61,19.43 D2.8
  other vias: 42.4,19.51 19.54,19.51 30.97,19.51 53.83,19.51 65.26,19.51
ROW5  (via drill 0.35)
  Top 0.203: D1.16 8.33,36.68 16.92,36.68 D2.16 19.76,36.68 27.33,36.68 27.85,36.15 27.85,34.97 28.25,34.57 29.31,34.57 29.77,35.03 D3.16 31.19,36.68 39.84,36.68 40.65,35.87 40.65,35.8 D4.16 42.62,36.68 51.27,36.68 52.08,35.87 52.08,35.8 D5.16 54.05,36.68 60.44,36.68 60.5,36.62 61.17,36.62 62.53,35.26 D6.16
  Bottom 0.203: IC1.20 17.58,21.59 17.58,22.3 19.96,24.69 26.21,24.69 26.57,24.33 28.5,24.33 29.01,24.84 29.01,31.19 28.25,31.95 28.25,33.98 29.52,35.26 D3.16 | LED006.A 40.18,23.34 40.18,34.24 D4.16
  other vias: 29.77,35.26 41.2,35.26 39.17,22.33
ROW6  (via drill 0.35)
  Top 0.203: D6.1 63.46,16.86 63.46,16.81 62.7,16.05 54.03,16.05 D5.1 52.03,16.86 52.03,16.81 51.27,16.05 42.6,16.05 D4.1 40.6,16.86 40.6,16.81 39.84,16.05 31.17,16.05 D3.1 29.17,16.86 29.17,16.81 28.41,16.05 19.74,16.05 D2.1 17.74,16.86 17.74,16.81 16.98,16.05 8.31,16.05 D1.1 | LED007.A 52.1,27.15 v52.12,27.13
  Bottom 0.203: IC1.19 18.72,20.65 18.34,20.27 D2.1 | v52.12,27.13 52.12,17.96 D5.1
  other vias: 18.34,17.46 52.63,17.46
ROW7  (via drill 0.35)
  Top 0.203: D1.12 16.29,33.47 17.28,33.47 18.5,32.25 25.65,32.25 26.78,33.38 27.48,33.38 | D6.12 71.66,32.67 71.23,32.25 63.38,32.25 63.36,32.27 60.7,32.27 60.67,32.25 60.25,32.25 | 48.79,32.25 40.52,32.25 40.5,32.27 37.39,32.27 37.37,32.26 | 48.79,32.25 49.24,32.25 49.27,32.27 53.03,32.27 53.05,32.25 60.25,32.25 | 27.48,33.38 28.18,33.38 v29.01,32.55 29.07,32.49 29.07,32.27 29.09,32.25 37.36,32.25 37.37,32.26 | 27.48,33.38 27.48,33.71 D2.12 | D4.12 48.8,32.26 48.79,32.25 | 60.25,32.25 60.23,32.27 D5.12 | D3.12 37.37,32.26
  Bottom 0.203: v29.01,32.55 29.06,32.5 29.06,31.71 29.41,31.36 29.41,24.67 28.67,23.93 26.4,23.93 26.04,24.28 22.1,24.28 19.99,22.17 IC1.18 | LED008.A 49.33,23.59 49.33,34.73 D4.12
  other vias: 48.8,35.26 50.6,22.33
ROW8  (via drill 0.35)
  Top 0.203: 62.03,29.25 v53.9,29.25 v42.47,29.25 v31.04,29.25 26.91,29.25 25.53,30.62 17.82,30.62 16.6,31.84 10.34,31.84 8.98,33.2 | 62.03,29.25 v65.33,29.25 | v9.37,33.2 9.18,33.2 8.98,33.2 | 8.98,33.2 D1.9 | LED009.A 62.03,29.25 | v16.31,35.51 16.31,34.98 17.39,33.89 18.85,33.89 D2.9
  Bottom 0.203: D5.9 53.83,29.32 v53.9,29.25 | D4.9 42.4,29.32 v42.47,29.25 | D3.9 30.97,29.32 | 30.97,29.32 v31.04,29.25 | D6.9 65.26,29.32 v65.33,29.25 | IC1.17 21.26,22.17 22.96,23.88 25.88,23.88 26.23,23.52 28.84,23.52 29.82,24.5 29.82,27.13 30.97,28.27 30.97,29.32 | v9.37,33.2 9.65,33.22 12.47,36.05 15.77,36.05 v16.31,35.51
  other vias: 30.97,33.21 42.4,33.21 53.83,33.21 65.26,33.21
ROW9  (via drill 0.35)
  Top 0.203: D1.15 9.02,35.41 9.09,35.41 9.96,36.27 16.62,36.27 17.38,35.51 17.38,34.48 17.56,34.3 19.28,34.3 D2.15 21.25,36.27 27.16,36.27 27.45,35.98 27.45,34.8 28.09,34.17 30.58,34.17 v31.61,35.19 D3.15 32.69,36.27 39.67,36.27 40.24,35.7 40.24,34.48 40.42,34.3 42.14,34.3 D4.15 44.12,36.27 51.1,36.27 51.67,35.7 51.67,34.48 51.85,34.3 53.57,34.3 D5.15 55.55,36.27 60.27,36.27 60.33,36.21 61.01,36.21 62.91,34.3 65,34.3 D6.15
  Bottom 0.203: IC1.16 22.53,22.17 23.82,23.47 25.71,23.47 26.06,23.11 29,23.11 30.23,24.34 30.23,26.96 31.06,27.79 31.55,27.79 32.31,28.55 32.31,33.92 31.68,34.54 31.68,35.12 v31.61,35.19 | LED010.A 63.55,23.85 63.55,32.85 D6.15
  other vias: 62.03,22.33 65.96,35.26
ROW10  (via drill 0.35)
  Top 0.203: 57.71,31.59 v57.71,31.45 57.71,31.84 | 57.71,31.84 51.78,31.84 51.76,31.87 49.43,31.87 49.41,31.84 46.81,31.84 | v68.89,31.45 68.49,31.84 63.22,31.84 63.19,31.87 60.86,31.87 60.84,31.84 57.71,31.84 | D2.13 22.94,34.16 20.91,34.16 v20.77,34.02 | 34.85,31.84 28.93,31.84 28.9,31.87 28.62,31.87 27.51,32.98 26.95,32.98 25.82,31.84 18.33,31.84 17.11,33.06 16.13,33.06 14.89,34.3 13.56,34.3 13.28,34.59 | 34.85,31.84 37.98,31.84 38,31.87 40.33,31.87 40.35,31.84 46.81,31.84 | v34.85,31.45 34.85,31.84 | 13.28,34.59 D1.13 12.61,35.22 v13.28,34.55 13.28,34.59 | v46.79,31.45 46.79,31.82 46.81,31.84 | v58.93,34.54 58.33,35.14 D5.13 | v64.87,36.52 64.84,36.52 STATUS.A
  Bottom 0.203: D4.13 46.28,34.63 46.28,31.95 v46.79,31.45 | v68.89,31.45 69.14,31.7 69.14,34.63 D6.13 | IC1.15 23.8,22.68 24.18,23.06 25.54,23.06 25.89,22.71 29.17,22.71 30.63,24.17 30.63,26.79 31.22,27.38 32.13,27.38 34.85,30.1 v34.85,31.45 34.85,33.48 35.47,34.1 D3.13 | v20.77,34.02 v20.76,34.01 15.53,34.01 15,34.55 v13.28,34.55 | v57.71,31.45 57.71,33.33 v58.93,34.54 59,34.47 62.81,34.47 v64.87,36.52
  other vias: 35.47,35.26 46.9,35.26 69.76,35.26
ROW11  (via drill 0.35)
  Top 0.203: D1.2 9.8,16.46 15.8,16.46 | 15.8,16.46 16.82,16.46 17.33,16.98 17.33,18.16 17.64,18.46 19.23,18.46 D2.2 21.23,16.46 28.25,16.46 28.76,16.98 28.76,18.16 29.07,18.46 30.66,18.46 D3.2 32.66,16.46 39.67,16.46 40.19,16.98 40.19,18.16 40.5,18.46 42.09,18.46 D4.2 44.09,16.46 51.1,16.46 51.62,16.98 51.62,18.16 51.93,18.46 53.52,18.46 D5.2 55.52,16.46 62.53,16.46 63.05,16.98 63.05,18.16 63.36,18.46 64.95,18.46 D6.2 66.13,17.45 67.08,16.5 72.44,16.5 72.69,16.76 72.69,35.99 71.91,36.78 69.42,36.78 WIFI.A | v15.74,16.97 15.74,16.52 15.8,16.46
  Bottom 0.203: IC1.14 23.8,30.05 21.13,27.38 19.29,27.38 18.09,26.18 18.09,24.88 16.02,22.82 15.96,22.82 15.57,22.44 15.57,17.13 v15.74,16.97
ROW12  (via drill 0.35)
  Top 0.203: 44.25,23.23 44.7,23.23 44.98,22.95 45.55,22.95 45.82,23.23 55.5,23.23 55.5,23.22 v55.79,22.93 55.82,22.95 56.72,22.95 57,23.23 66.16,23.23 v66.46,22.93 | 44.25,23.23 34.14,23.23 33.86,22.95 32.96,22.95 v32.82,22.81 29.95,22.81 28.42,21.28 28.42,21.26 28.02,20.86 27.45,20.86 27.05,21.26 27.05,21.28 25.86,22.48 18.19,22.48 | 18.19,22.48 17.13,21.42 13.49,21.42 11.73,19.66 11.73,18.48 D1.3 | 18.19,22.48 17.43,23.23 16.02,23.23 v15.74,23.51 | v44.25,22.81 44.25,23.23
  Bottom 0.203: D4.3 44.25,18.21 v44.25,22.81 | D5.3 55.75,18.14 55.75,22.88 v55.79,22.93 | D3.3 33.07,17.95 32.82,18.21 | 32.82,18.21 v32.82,22.81 | v66.46,22.93 66.46,18.85 D6.3 | IC1.13 22.53,29.35 20.96,27.79 19.12,27.79 17.68,26.35 17.68,25.52 15.8,23.64 15.8,23.56 v15.74,23.51 | D2.3 23.02,18.34 32.69,18.34 32.82,18.21
  other vias: 45,17.46 22.14,17.46 33.57,17.46 56.43,17.46 67.86,17.46
ROW13  (via drill 0.35)
  Top 0.203: D1.4 13.56,18.41 14.53,18.41 16.13,20.01 16.13,20.04 16.7,20.61 17.47,20.61 17.73,20.87 26.29,20.87 27.12,20.04 28.36,20.04 29.18,20.87 34.85,20.87 | 34.85,20.87 46.28,20.87 | 46.28,20.87 58.47,20.87 | 58.47,20.87 69.9,20.87 70.16,21.12 v70.16,21.29 | 46.28,20.87 v46.28,21.29 | v58.47,21.29 58.47,20.87 | 34.85,20.87 34.85,21.03 v34.59,21.29
  Bottom 0.203: v46.28,21.29 46.28,18.07 D4.4 | v58.47,21.29 57.96,20.78 57.96,17.82 D5.4 | v34.59,21.29 34.85,21.03 34.85,18.07 D3.4 | D6.4 69.76,20.89 v70.16,21.29 | IC1.12 21.26,29.54 20.37,28.65 18.34,28.65 14.02,24.33 14.02,23.88 12.97,22.83 12.97,20.49 12.5,20.01 12.5,17.57 D1.4 14.01,16.05 22.76,16.05 24.04,17.33 D2.4
  other vias: 46.9,17.46 12.61,17.46 24.04,17.46 35.47,17.46 58.33,17.46 69.76,17.46
ROW14  (via drill 0.35)
  Top 0.203: D1.5 v16.82,19.76 17.25,20.2 17.64,20.2 17.9,20.46 26.13,20.46 26.95,19.64 | D4.5 48.8,20.44 48.82,20.46 | D5.5 60.23,20.44 60.25,20.46 | D6.5 71.66,20.04 71.23,20.46 60.25,20.46 | D3.5 37.37,20.44 37.39,20.46 | 26.95,19.64 28.52,19.64 29.35,20.46 37.39,20.46 | D2.5 25.94,18.63 26.95,19.64 | 60.25,20.46 48.82,20.46 | 48.82,20.46 37.39,20.46
  Bottom 0.203: IC1.11 19.99,31.57 20.51,32.09 24.05,32.09 24.41,31.74 24.41,29.7 17.49,22.79 17.2,22.79 16.82,22.41 v16.82,19.76
S0  (via drill 0.35)
  Top 0.203: v30.33,37.77 28.57,37.77 SW0.2B
  Bottom 0.203: v30.33,37.77 30.5,37.59 38.25,37.59 38.63,37.21 47.3,37.21 48.09,36.42 50.37,36.42 50.86,35.94 56.71,35.94 57.42,35.23 60.69,35.23 61.05,34.87 62.5,34.87 64.19,36.56 64.19,36.81 64.72,37.34 68.73,37.34 71.58,34.49 71.58,30.88 69.97,29.26 69.97,26.87 71.98,24.85 71.98,17.35 70.08,15.44 65.58,15.44 ESPCONNECTOR.5
S1  (via drill 0.35)
  Top 0.203: v38.91,37.9 37.04,37.9 SW1.2B
  Bottom 0.203: ESPCONNECTOR.4 67.72,15.04 70.41,15.04 72.39,17.02 72.39,25.02 70.37,27.04 70.37,29.09 71.98,30.71 71.98,34.66 68.89,37.74 64.55,37.74 63.78,36.98 63.78,36.73 62.33,35.28 61.22,35.28 60.81,35.69 57.54,35.69 56.88,36.34 51.03,36.34 50.54,36.83 48.26,36.83 47.32,37.77 39.04,37.77 v38.91,37.9
S2  (via drill 0.35)
  Top 0.203: v47.68,38.38 47.33,38.03 SW2.2B
  Bottom 0.203: ESPCONNECTOR.2 72.8,15.04 72.8,34.99 69.23,38.56 61.22,38.56 60.4,37.74 48.31,37.74 v47.68,38.38
S3  (via drill 0.35)
  Top 0.203: v60.25,38.56 59.69,38 58.9,38 SW3.2B
  Bottom 0.203: ESPCONNECTOR.1 73.2,14.68 73.2,35.16 69.4,38.96 60.66,38.96 v60.25,38.56
SCL  (via drill 0.35)
  Top 0.203: R2.1 6.38,29.08 v7.5,29.08
  Bottom 0.203: IC1.26 9.83,22.68 7.5,25.01 7.5,26.36 | v7.5,29.08 7.5,26.36 | 7.5,26.36 3.32,26.36 2.59,25.64 2.59,17.48 arc90 6.15,13.92 22.5,13.92 arc-90 23.75,12.68 arc67 26.11,11.1 33.3,11.1 arc90 ESPCONNECTOR.16
SDA  (via drill 0.35)
  Top 0.203: R1.1 4.44,24.41 v5.88,24.41
  Bottom 0.203: IC1.27 8.56,22.94 7.08,24.41 v5.88,24.41 5.88,25.37 5.38,25.86 3.38,25.86 3.1,25.57 3.1,17.48 arc90 6.15,14.43 23.07,14.43 arc41 25.04,15.16 arc-49 26.59,15.88 36.45,15.88 arc-90 ESPCONNECTOR.15

### Text on the board
bPlace: GND | 3v3 | SCL | SDA | SW0 | SW1 | SW2 | SW3 | © 2019 Darren Dignam | WWW.TICKERTAPE.CC
tDocu: Darren Dignam